# EAGLE schematic LED cube1 (EAGLE 7.5.0)
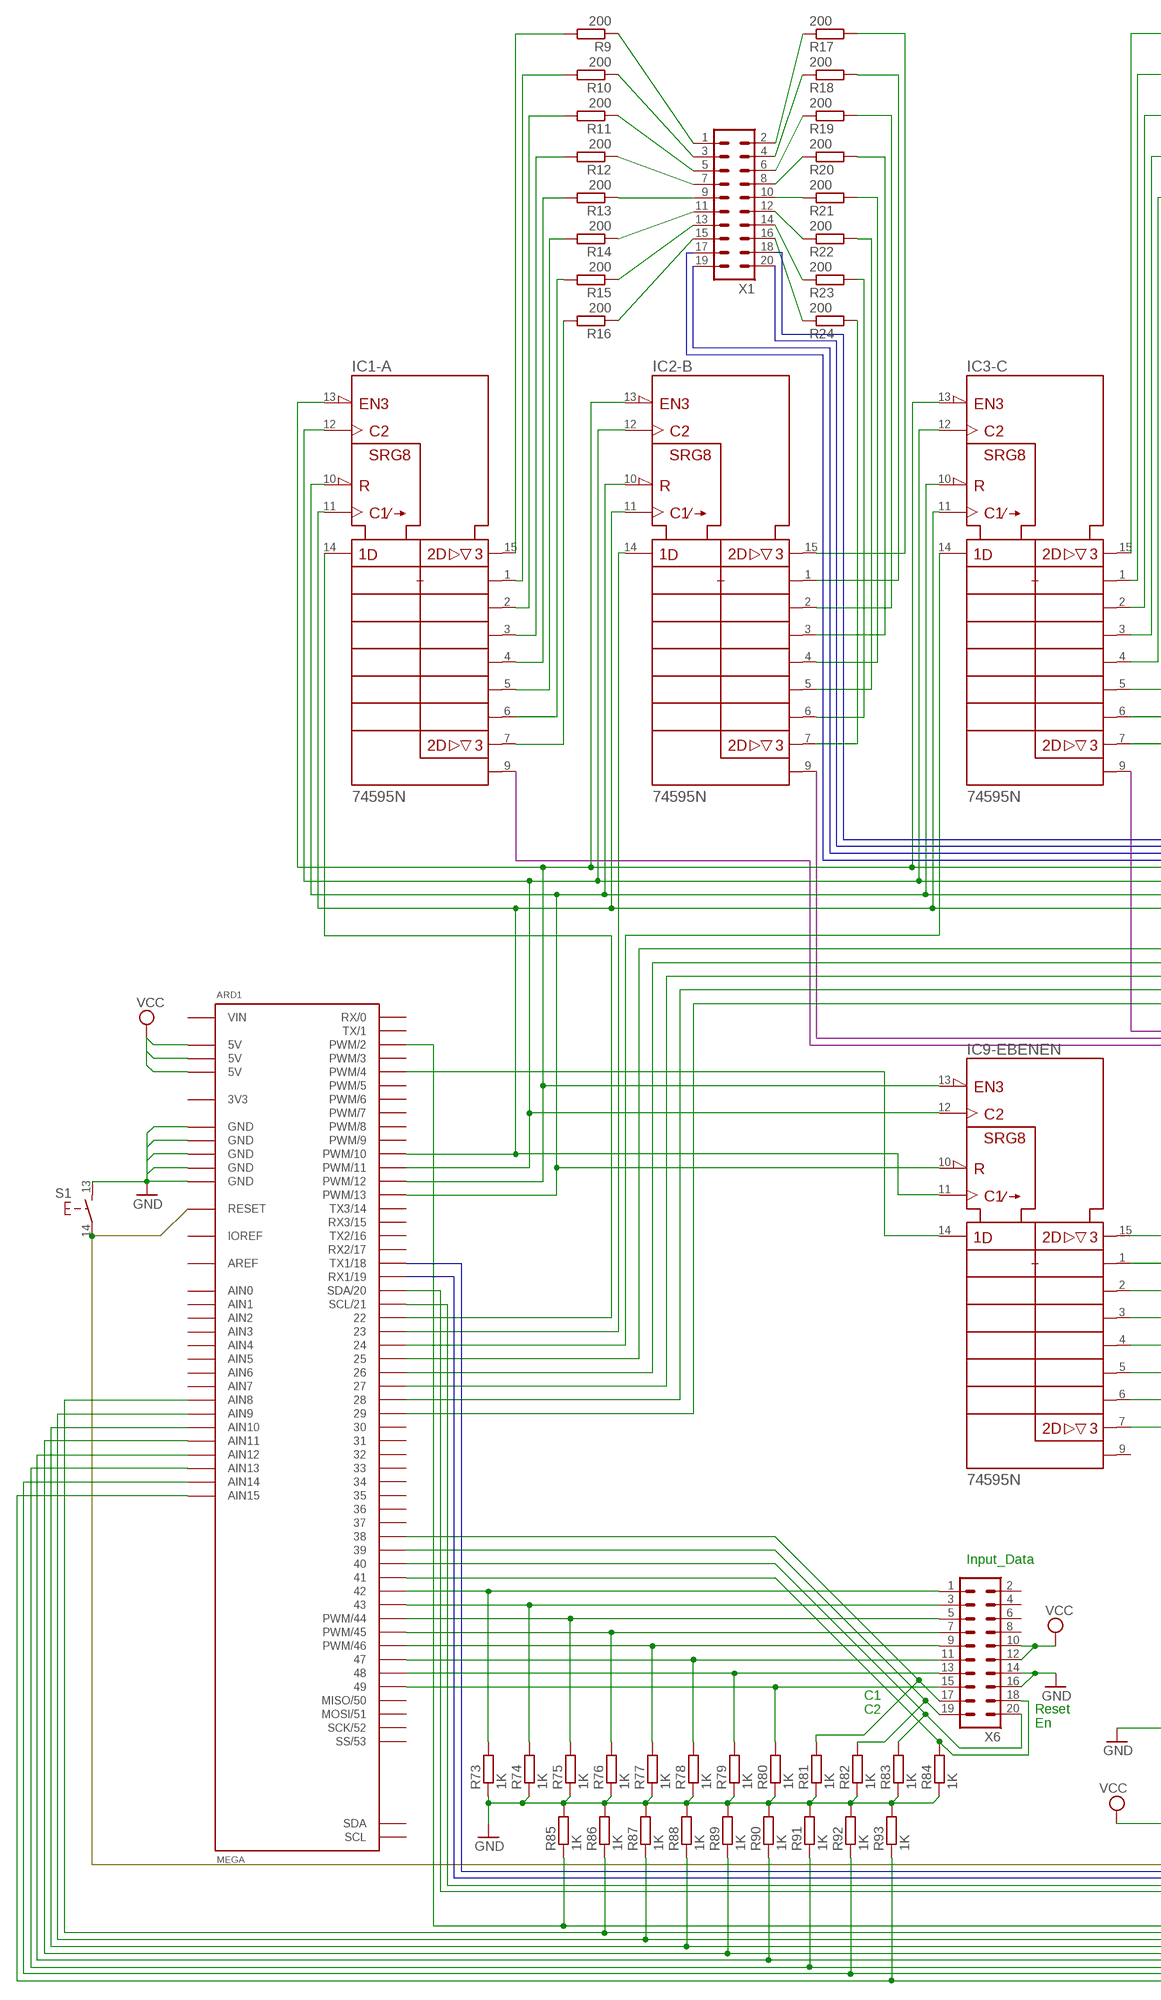
[diagram p0: schematic, sheet 1, part 1 of 2]
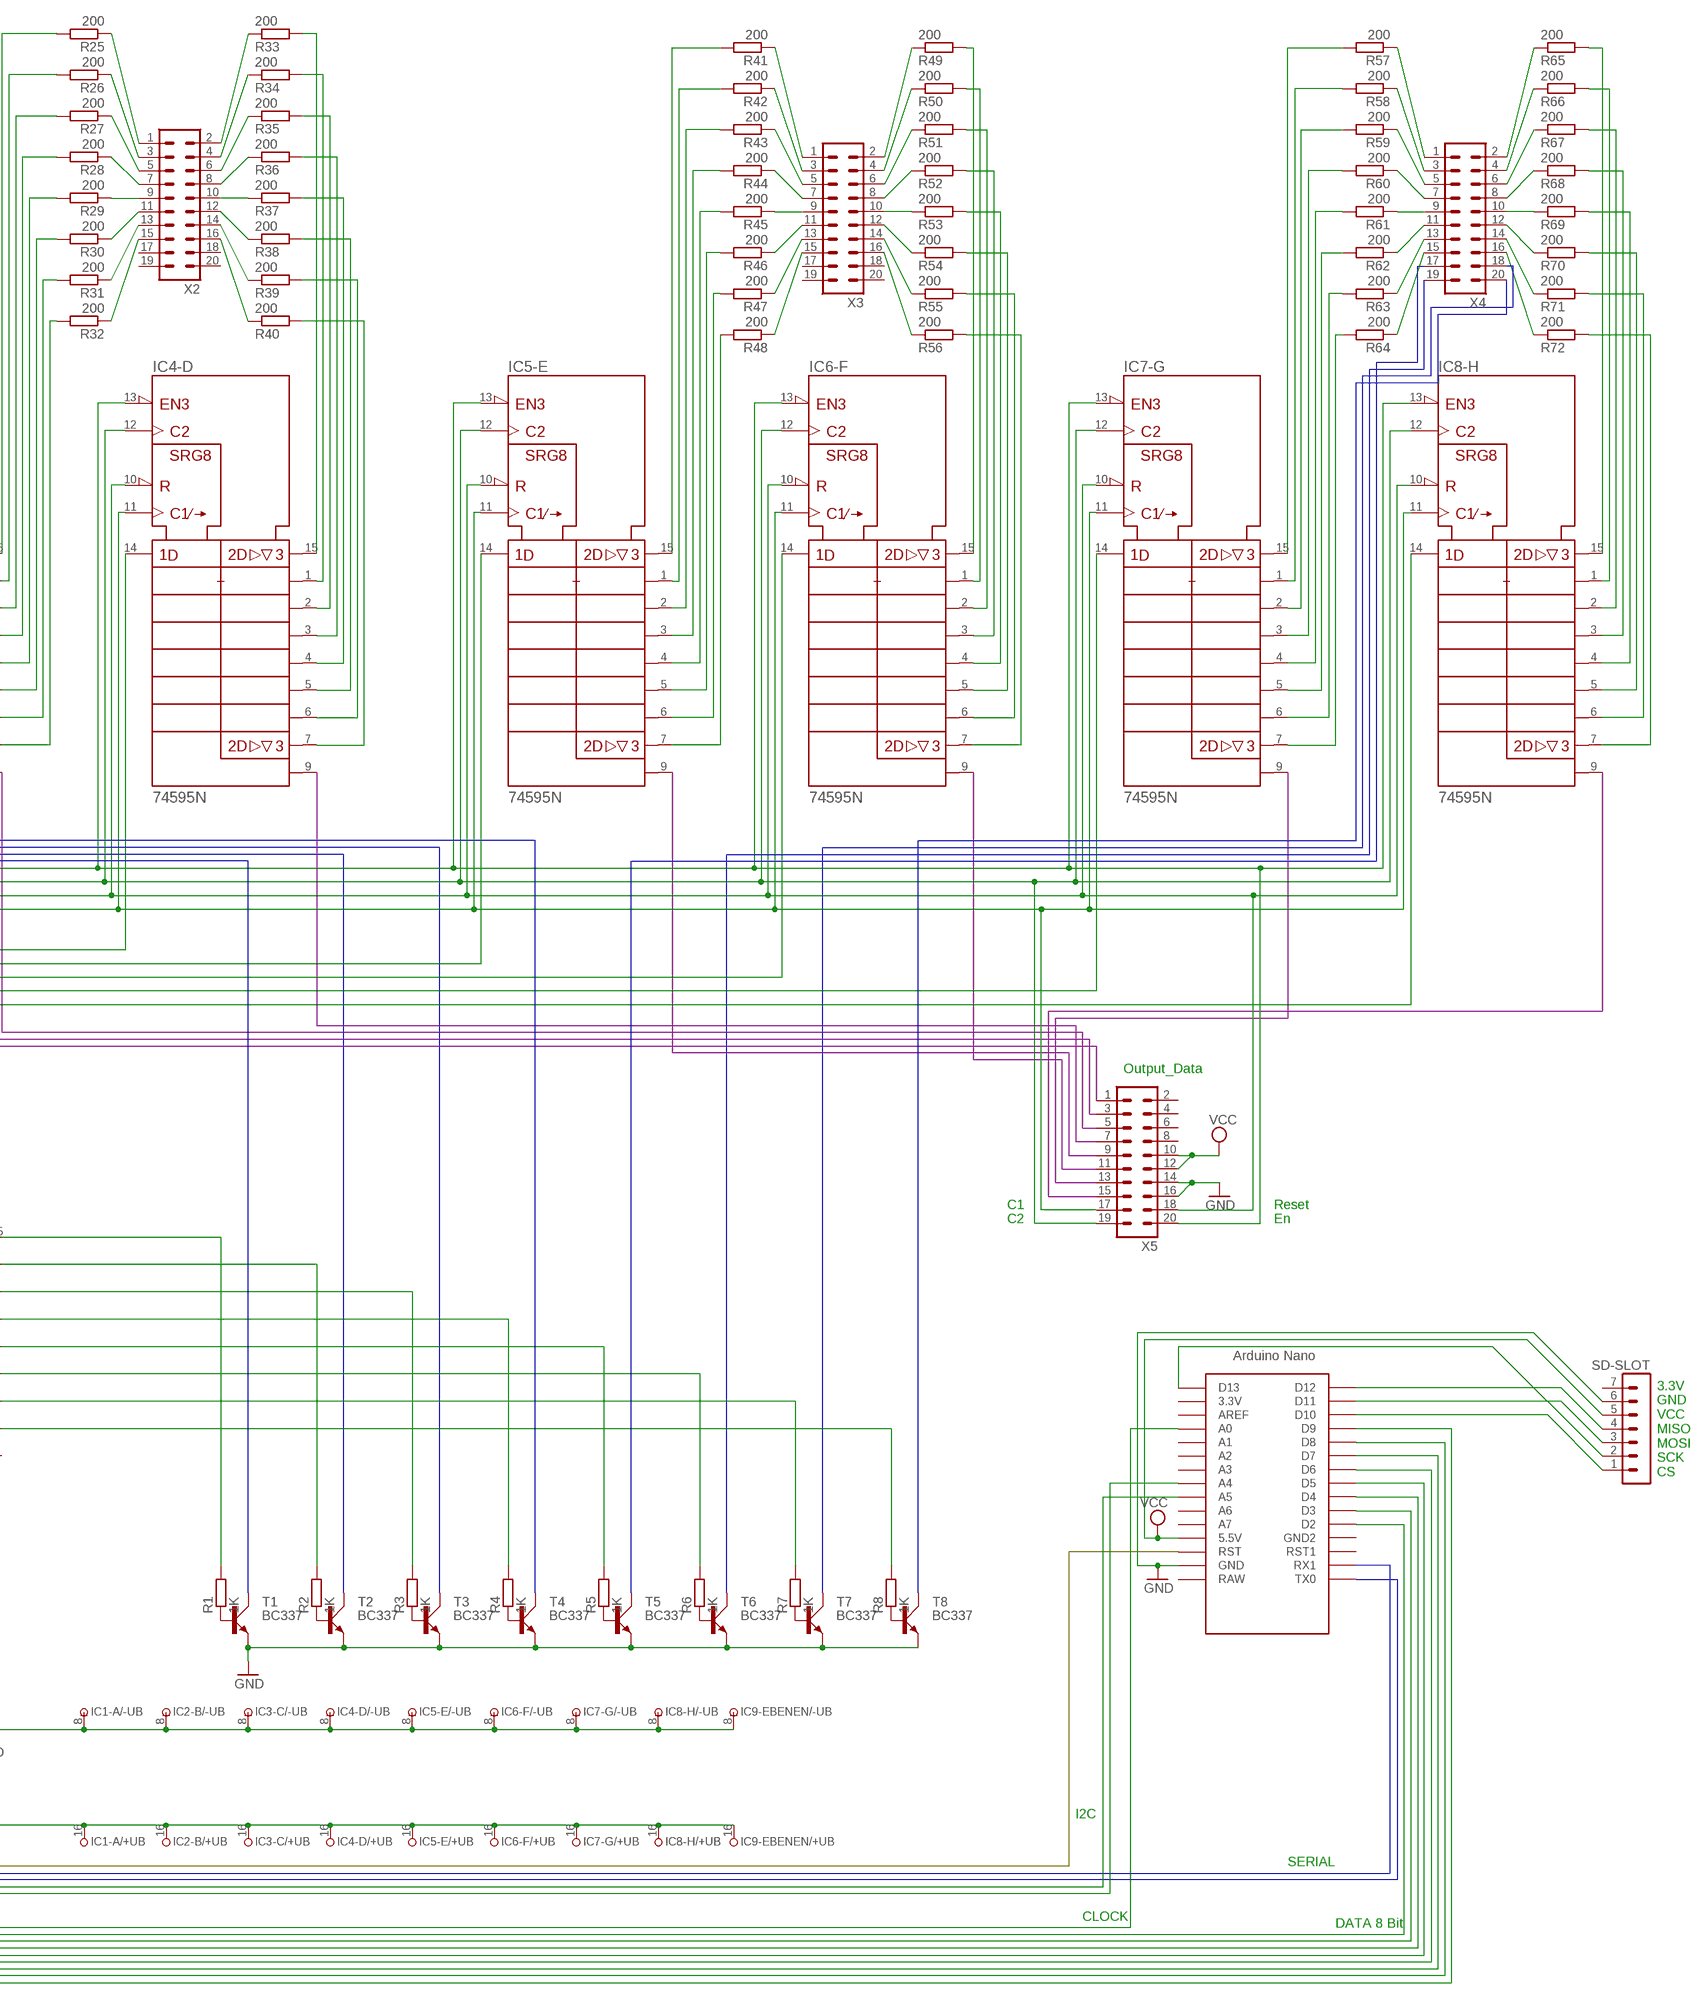
[diagram p1: schematic, sheet 1, part 2 of 2]

## Parts
ARD1  MEGA  [MEGA]
IC1-A  74595N  [DIL16]
IC2-B  74595N  [DIL16]
IC3-C  74595N  [DIL16]
IC4-D  74595N  [DIL16]
IC5-E  74595N  [DIL16]
IC6-F  74595N  [DIL16]
IC7-G  74595N  [DIL16]
IC8-H  74595N  [DIL16]
IC9-EBENEN  74595N  [DIL16]
R1  1K  R-EU_0207/7  [0207/7]
R2  1K  R-EU_0207/7  [0207/7]
R3  1K  R-EU_0207/7  [0207/7]
R4  1K  R-EU_0207/7  [0207/7]
R5  1K  R-EU_0207/7  [0207/7]
R6  1K  R-EU_0207/7  [0207/7]
R7  1K  R-EU_0207/7  [0207/7]
R8  1K  R-EU_0207/7  [0207/7]
R9  200  R-EU_0207/7  [0207/7]
R10  200  R-EU_0207/7  [0207/7]
R11  200  R-EU_0207/7  [0207/7]
R12  200  R-EU_0207/7  [0207/7]
R13  200  R-EU_0207/7  [0207/7]
R14  200  R-EU_0207/7  [0207/7]
R15  200  R-EU_0207/7  [0207/7]
R16  200  R-EU_0207/7  [0207/7]
R17  200  R-EU_0207/7  [0207/7]
R18  200  R-EU_0207/7  [0207/7]
R19  200  R-EU_0207/7  [0207/7]
R20  200  R-EU_0207/7  [0207/7]
R21  200  R-EU_0207/7  [0207/7]
R22  200  R-EU_0207/7  [0207/7]
R23  200  R-EU_0207/7  [0207/7]
R24  200  R-EU_0207/7  [0207/7]
R25  200  R-EU_0207/7  [0207/7]
R26  200  R-EU_0207/7  [0207/7]
R27  200  R-EU_0207/7  [0207/7]
R28  200  R-EU_0207/7  [0207/7]
R29  200  R-EU_0207/7  [0207/7]
R30  200  R-EU_0207/7  [0207/7]
R31  200  R-EU_0207/7  [0207/7]
R32  200  R-EU_0207/7  [0207/7]
R33  200  R-EU_0207/7  [0207/7]
R34  200  R-EU_0207/7  [0207/7]
R35  200  R-EU_0207/7  [0207/7]
R36  200  R-EU_0207/7  [0207/7]
R37  200  R-EU_0207/7  [0207/7]
R38  200  R-EU_0207/7  [0207/7]
R39  200  R-EU_0207/7  [0207/7]
R40  200  R-EU_0207/7  [0207/7]
R41  200  R-EU_0207/7  [0207/7]
R42  200  R-EU_0207/7  [0207/7]
R43  200  R-EU_0207/7  [0207/7]
R44  200  R-EU_0207/7  [0207/7]
R45  200  R-EU_0207/7  [0207/7]
R46  200  R-EU_0207/7  [0207/7]
R47  200  R-EU_0207/7  [0207/7]
R48  200  R-EU_0207/7  [0207/7]
R49  200  R-EU_0207/7  [0207/7]
R50  200  R-EU_0207/7  [0207/7]
R51  200  R-EU_0207/7  [0207/7]
R52  200  R-EU_0207/7  [0207/7]
R53  200  R-EU_0207/7  [0207/7]
R54  200  R-EU_0207/7  [0207/7]
R55  200  R-EU_0207/7  [0207/7]
R56  200  R-EU_0207/7  [0207/7]
R57  200  R-EU_0207/7  [0207/7]
R58  200  R-EU_0207/7  [0207/7]
R59  200  R-EU_0207/7  [0207/7]
R60  200  R-EU_0207/7  [0207/7]
R61  200  R-EU_0207/7  [0207/7]
R62  200  R-EU_0207/7  [0207/7]
R63  200  R-EU_0207/7  [0207/7]
R64  200  R-EU_0207/7  [0207/7]
R65  200  R-EU_0207/7  [0207/7]
R66  200  R-EU_0207/7  [0207/7]
R67  200  R-EU_0207/7  [0207/7]
R68  200  R-EU_0207/7  [0207/7]
R69  200  R-EU_0207/7  [0207/7]
R70  200  R-EU_0207/7  [0207/7]
R71  200  R-EU_0207/7  [0207/7]
R72  200  R-EU_0207/7  [0207/7]
R73  1K  R-EU_0207/7  [0207/7]
R74  1K  R-EU_0207/7  [0207/7]
R75  1K  R-EU_0207/7  [0207/7]
R76  1K  R-EU_0207/7  [0207/7]
R77  1K  R-EU_0207/7  [0207/7]
R78  1K  R-EU_0207/7  [0207/7]
R79  1K  R-EU_0207/7  [0207/7]
R80  1K  R-EU_0207/7  [0207/7]
R81  1K  R-EU_0207/7  [0207/7]
R82  1K  R-EU_0207/7  [0207/7]
R83  1K  R-EU_0207/7  [0207/7]
R84  1K  R-EU_0207/7  [0207/7]
R85  1K  R-EU_0207/7  [0207/7]
R86  1K  R-EU_0207/7  [0207/7]
R87  1K  R-EU_0207/7  [0207/7]
R88  1K  R-EU_0207/7  [0207/7]
R89  1K  R-EU_0207/7  [0207/7]
R90  1K  R-EU_0207/7  [0207/7]
R91  1K  R-EU_0207/7  [0207/7]
R92  1K  R-EU_0207/7  [0207/7]
R93  1K  R-EU_0207/7  [0207/7]
S1  TASTER_SCHLIESSER  [EINTASTER]
SD-SLOT  MA07-1  [MA07-1]
T1  BC337  [SOT54A]
T2  BC337  [SOT54A]
T3  BC337  [SOT54A]
T4  BC337  [SOT54A]
T5  BC337  [SOT54A]
T6  BC337  [SOT54A]
T7  BC337  [SOT54A]
T8  BC337  [SOT54A]
U$1  NANO  [NANO]
X1  MA10-2  [MA10-2]
X2  MA10-2  [MA10-2]
X3  MA10-2  [MA10-2]
X4  MA10-2  [MA10-2]
X5  MA10-2  [MA10-2]
X6  MA10-2  [MA10-2]

## Nets
GND: ARD1.GND1(GND) ARD1.GND2(GND) ARD1.GND3(GND) ARD1.GND4(GND) ARD1.GND5(GND) IC1-A.8(-UB) IC2-B.8(-UB) IC3-C.8(-UB) IC4-D.8(-UB) IC5-E.8(-UB) IC6-F.8(-UB) IC7-G.8(-UB) IC8-H.8(-UB) IC9-EBENEN.8(-UB) R73.1 R74.1 R75.1 R76.1 R77.1 R78.1 R79.1 R80.1 R81.1 R82.1 R83.1 R84.1 S1.13 SD-SLOT.6 T1.E T2.E T3.E T4.E T5.E T6.E T7.E T8.E U$1.GND X5.14 X5.16 X6.14 X6.16
N$1: ARD1.22 IC1-A.14(SER)
N$2: ARD1.23 IC2-B.14(SER)
N$3: ARD1.24 IC3-C.14(SER)
N$4: ARD1.25 IC4-D.14(SER)
N$5: ARD1.26 IC5-E.14(SER)
N$6: ARD1.27 IC6-F.14(SER)
N$7: ARD1.28 IC7-G.14(SER)
N$8: ARD1.29 IC8-H.14(SER)
N$9: ARD1.40 R83.2 X6.20
N$10: ARD1.13(PWM/13) IC1-A.10(!SRCLR) IC2-B.10(!SRCLR) IC3-C.10(!SRCLR) IC4-D.10(!SRCLR) IC5-E.10(!SRCLR) IC6-F.10(!SRCLR) IC7-G.10(!SRCLR) IC8-H.10(!SRCLR) IC9-EBENEN.10(!SRCLR) X5.18
N$11: ARD1.11(PWM/11) IC1-A.12(RCK) IC2-B.12(RCK) IC3-C.12(RCK) IC4-D.12(RCK) IC5-E.12(RCK) IC6-F.12(RCK) IC7-G.12(RCK) IC8-H.12(RCK) IC9-EBENEN.12(RCK) X5.19
N$12: ARD1.4(PWM/4) IC9-EBENEN.14(SER)
N$13: ARD1.12(PWM/12) IC1-A.13(!G) IC2-B.13(!G) IC3-C.13(!G) IC4-D.13(!G) IC5-E.13(!G) IC6-F.13(!G) IC7-G.13(!G) IC8-H.13(!G) IC9-EBENEN.13(!G) X5.20
N$14: R1.1 T1.B
N$15: R2.1 T2.B
N$16: R9.1 X1.1
N$17: R10.1 X1.3
N$18: R11.1 X1.5
N$19: R12.1 X1.7
N$20: R13.1 X1.9
N$21: R14.1 X1.11
N$22: R15.1 X1.13
N$23: R16.1 X1.15
N$24: R17.1
N$25: R18.1
N$26: R19.1
N$27: R20.1
N$28: R21.1
N$29: R22.1
N$30: R23.1
N$31: R24.1
N$32: R25.1 X2.1
N$33: R26.1 X2.3
N$34: R27.1 X2.5
N$35: R28.1 X2.7
N$36: R29.1 X2.9
N$37: R30.1 X2.11
N$38: R31.1 X2.13
N$39: R32.1 X2.15
N$40: R33.1 X2.2
N$41: R34.1 X2.4
N$42: R35.1 X2.6
N$43: R36.1 X2.8
N$44: R37.1 X2.10
N$45: R38.1 X2.12
N$46: R39.1 X2.14
N$47: R40.1 X2.16
N$48: R41.1 X3.1
N$49: R42.1 X3.3
N$50: R43.1 X3.5
N$51: R44.1 X3.7
N$52: R45.1 X3.9
N$53: R46.1 X3.11
N$54: R47.1 X3.13
N$55: R48.1 X3.15
N$56: R49.1 X3.2
N$57: R50.1 X3.4
N$58: R51.1 X3.6
N$59: R52.1 X3.8
N$60: R53.1 X3.10
N$61: R54.1 X3.12
N$62: R55.1 X3.14
N$63: R56.1 X3.16
N$64: R57.1 X4.1
N$65: R58.1 X4.3
N$66: R59.1 X4.5
N$67: R60.1 X4.7
N$68: R61.1 X4.9
N$69: R62.1 X4.11
N$70: R63.1 X4.13
N$71: R64.1 X4.15
N$72: R65.1 X4.2
N$73: R66.1 X4.4
N$74: R67.1 X4.6
N$75: R68.1 X4.8
N$76: R69.1 X4.10
N$77: R70.1 X4.12
N$78: R71.1 X4.14
N$79: R72.1 X4.16
N$80: IC1-A.15(QA) R9.2
N$81: IC1-A.1(QB) R10.2
N$82: IC1-A.2(QC) R11.2
N$83: IC1-A.3(QD) R12.2
N$84: IC1-A.4(QE) R13.2
N$85: IC1-A.5(QF) R14.2
N$86: IC1-A.6(QG) R15.2
N$87: IC1-A.7(QH) R16.2
N$88: IC2-B.15(QA) R17.2
N$89: IC2-B.1(QB) R18.2
N$90: IC2-B.2(QC) R19.2
N$91: IC2-B.3(QD) R20.2
N$92: IC2-B.4(QE) R21.2
N$93: R22.2
N$94: IC2-B.6(QG) R23.2
N$95: IC2-B.7(QH) R24.2
N$96: IC3-C.15(QA) R25.2
N$97: IC3-C.1(QB) R26.2
N$98: IC3-C.2(QC) R27.2
N$99: IC3-C.3(QD) R28.2
N$100: IC3-C.4(QE) R29.2
N$101: IC3-C.5(QF) R30.2
N$102: IC3-C.6(QG) R31.2
N$103: IC3-C.7(QH) R32.2
N$104: IC4-D.15(QA) R33.2
N$105: IC4-D.1(QB) R34.2
N$106: IC4-D.2(QC) R35.2
N$107: IC4-D.3(QD) R36.2
N$108: IC4-D.4(QE) R37.2
N$109: IC4-D.5(QF) R38.2
N$110: IC4-D.6(QG) R39.2
N$111: IC4-D.7(QH) R40.2
N$112: IC5-E.15(QA) R41.2
N$113: IC5-E.1(QB) R42.2
N$114: IC5-E.2(QC) R43.2
N$115: IC5-E.3(QD) R44.2
N$116: IC5-E.4(QE) R45.2
N$117: IC5-E.5(QF) R46.2
N$118: R47.2
N$119: IC5-E.6(QG)
N$120: IC5-E.7(QH) R48.2
N$121: IC6-F.15(QA) R49.2
N$122: IC6-F.7(QH) R56.2
N$123: IC7-G.15(QA) R57.2
N$124: IC7-G.1(QB) R58.2
N$125: IC7-G.2(QC) R59.2
N$126: IC7-G.3(QD) R60.2
N$127: IC7-G.4(QE) R61.2
N$128: IC6-F.1(QB) R50.2
N$129: IC6-F.2(QC) R51.2
N$130: IC6-F.3(QD) R52.2
N$131: IC6-F.4(QE) R53.2
N$132: IC6-F.5(QF) R54.2
N$133: IC6-F.6(QG) R55.2
N$134: IC7-G.5(QF) R62.2
N$135: IC7-G.6(QG) R63.2
N$136: IC7-G.7(QH) R64.2
N$137: IC8-H.15(QA) R65.2
N$138: IC8-H.1(QB) R66.2
N$139: IC8-H.2(QC) R67.2
N$140: IC8-H.3(QD) R68.2
N$141: IC8-H.4(QE) R69.2
N$142: IC8-H.5(QF) R70.2
N$143: IC8-H.6(QG) R71.2
N$144: IC8-H.7(QH) R72.2
N$145: R3.1 T3.B
N$146: R4.1 T4.B
N$147: R5.1 T5.B
N$148: R6.1 T6.B
N$149: R7.1 T7.B
N$150: R8.1 T8.B
N$151: IC9-EBENEN.15(QA) R1.2
N$152: IC9-EBENEN.1(QB) R2.2
N$153: IC9-EBENEN.2(QC) R3.2
N$154: IC9-EBENEN.3(QD) R4.2
N$155: IC9-EBENEN.4(QE) R5.2
N$156: IC9-EBENEN.5(QF) R6.2
N$157: IC9-EBENEN.6(QG) R7.2
N$158: IC9-EBENEN.7(QH) R8.2
N$159: ARD1.10(PWM/10) IC1-A.11(SRCK) IC2-B.11(SRCK) IC3-C.11(SRCK) IC4-D.11(SRCK) IC5-E.11(SRCK) IC6-F.11(SRCK) IC7-G.11(SRCK) IC8-H.11(SRCK) IC9-EBENEN.11(SRCK) X5.17
N$160: ARD1.41 R84.2 X6.18
N$161: ARD1.42 R73.2 X6.1
N$162: ARD1.43 R74.2 X6.3
N$163: ARD1.44(PWM/44) R75.2 X6.5
N$164: ARD1.45(PWM/45) R76.2 X6.7
N$165: ARD1.46(PWM/46) R77.2 X6.9
N$166: ARD1.47 R78.2 X6.11
N$167: ARD1.48 R79.2 X6.13
N$168: ARD1.49 R80.2 X6.15
N$169: ARD1.38 R81.2 X6.17
N$170: ARD1.39 R82.2 X6.19
N$171: SD-SLOT.1 U$1.D10
N$172: SD-SLOT.2 U$1.D13
N$173: SD-SLOT.3 U$1.D11
N$174: SD-SLOT.4 U$1.D12
N$175: S1.14
N$176: ARD1.20(SDA/20) U$1.A4
N$177: ARD1.AIN8 R86.1 U$1.D2
N$178: ARD1.AIN9 R87.1 U$1.D3
N$179: ARD1.AIN10 R88.1 U$1.D4
N$180: ARD1.AIN11 R89.1 U$1.D5
N$181: ARD1.AIN12 R90.1 U$1.D6
N$182: ARD1.AIN13 R91.1 U$1.D7
N$183: ARD1.AIN14 R92.1 U$1.D8
N$184: ARD1.AIN15 R93.1 U$1.D9
N$185: ARD1.2(PWM/2) R85.1 U$1.A0
N$186: ARD1.21(SCL/21) U$1.A5
VCC: ARD1.5V1(5V) ARD1.5V2(5V) ARD1.5V3(5V) IC1-A.16(+UB) IC2-B.16(+UB) IC3-C.16(+UB) IC4-D.16(+UB) IC5-E.16(+UB) IC6-F.16(+UB) IC7-G.16(+UB) IC8-H.16(+UB) IC9-EBENEN.16(+UB) SD-SLOT.5 U$1.5V(5.5V) X5.10 X5.12 X6.10 X6.12
Unconnected: ARD1.0(RX/0) ARD1.1(TX/1) ARD1.3(PWM/3) ARD1.5(PWM/5) ARD1.6(PWM/6) ARD1.7(PWM/7) ARD1.8(PWM/8) ARD1.9(PWM/9) ARD1.14(TX3/14) ARD1.15(RX3/15) ARD1.16(TX2/16) ARD1.17(RX2/17) ARD1.18(TX1/18) ARD1.19(RX1/19) ARD1.30 ARD1.31 ARD1.32 ARD1.33 ARD1.34 ARD1.35 ARD1.36 ARD1.37 ARD1.50(MISO/50) ARD1.51(MOSI/51) ARD1.52(SCK/52) ARD1.53(SS/53) ARD1.AIN0 ARD1.AIN1 ARD1.AIN2 ARD1.AIN3 ARD1.AIN4 ARD1.AIN5 ARD1.AIN6 ARD1.AIN7 ARD1.RST(RESET) ARD1.SCL ARD1.SDA IC1-A.9(QH*) IC2-B.5(QF) IC2-B.9(QH*) IC3-C.9(QH*) IC4-D.9(QH*) IC5-E.9(QH*) IC6-F.9(QH*) IC7-G.9(QH*) IC8-H.9(QH*) IC9-EBENEN.9(QH*) R85.2 R86.2 R87.2 R88.2 R89.2 R90.2 R91.2 R92.2 R93.2 SD-SLOT.7 T1.C T2.C T3.C T4.C T5.C T6.C T7.C T8.C U$1.3.3V U$1.A1 U$1.A2 U$1.A3 U$1.A6 U$1.A7 U$1.AREF U$1.GND1(GND2) U$1.ICSP1 U$1.ICSP2 U$1.ICSP3 U$1.ICSP4 U$1.ICSP5 U$1.ICSP6 U$1.RAW U$1.RST U$1.RST1 U$1.RX1 U$1.TX0 X1.2 X1.4 X1.6 X1.8 X1.10 X1.12 X1.14 X1.16 X1.17 X1.18 X1.19 X1.20 X2.17 X2.18 X2.19 X2.20 X3.17 X3.18 X3.19 X3.20 X4.17 X4.18 X4.19 X4.20 X5.1 X5.2 X5.3 X5.4 X5.5 X5.6 X5.7 X5.8 X5.9 X5.11 X5.13 X5.15 X6.2 X6.4 X6.6 X6.8

## Buses
B$1
B$2
B$3
B$4
B$5
B$6
B$7
B$8
B$9
B$10

## Notes on the sheet
- Output_Data
- C1
  C2
- Reset
  En
- 3.3V
  GND
  VCC
  MISO
  MOSI
  SCK
  CS
- Input_Data
- C1
  C2
- Reset
  En
- I2C
- SERIAL
- CLOCK
- DATA 8 Bit

## Power pins joined to a net without a drawn wire
3V3: ARD1.3V3
AREF: ARD1.AREF
IOREF: ARD1.IOREF
VIN: ARD1.VIN

## Library data of the parts
ARD1 = welectronic:MEGA: Arduino MEGA
IC1-A IC2-B IC3-C IC4-D IC5-E IC6-F IC7-G IC8-H IC9-EBENEN = 74ttl-din:74*595: 8-bit SHIFT REGISTER, output latch
R1-R93 = rcl:R-EU_: RESISTOR, European symbol
S1 = e-schalter:TASTER_SCHLIESSER: Ein-Taster (Arbeitskontakt)
SD-SLOT = con-lstb:MA07-1: PIN HEADER; OC_FARNELL: unknown; OC_NEWARK: unknown
T1-T8 = transistor-small-signal:BC337: NPN TRANSISTOR
U$1 = Arduino-clone:NANO: Arduino Nano
X1-X6 = con-lstb:MA10-2: PIN HEADER; OC_FARNELL: unknown; OC_NEWARK: unknown